# EAGLE design touchsynth (EAGLE 6.2)
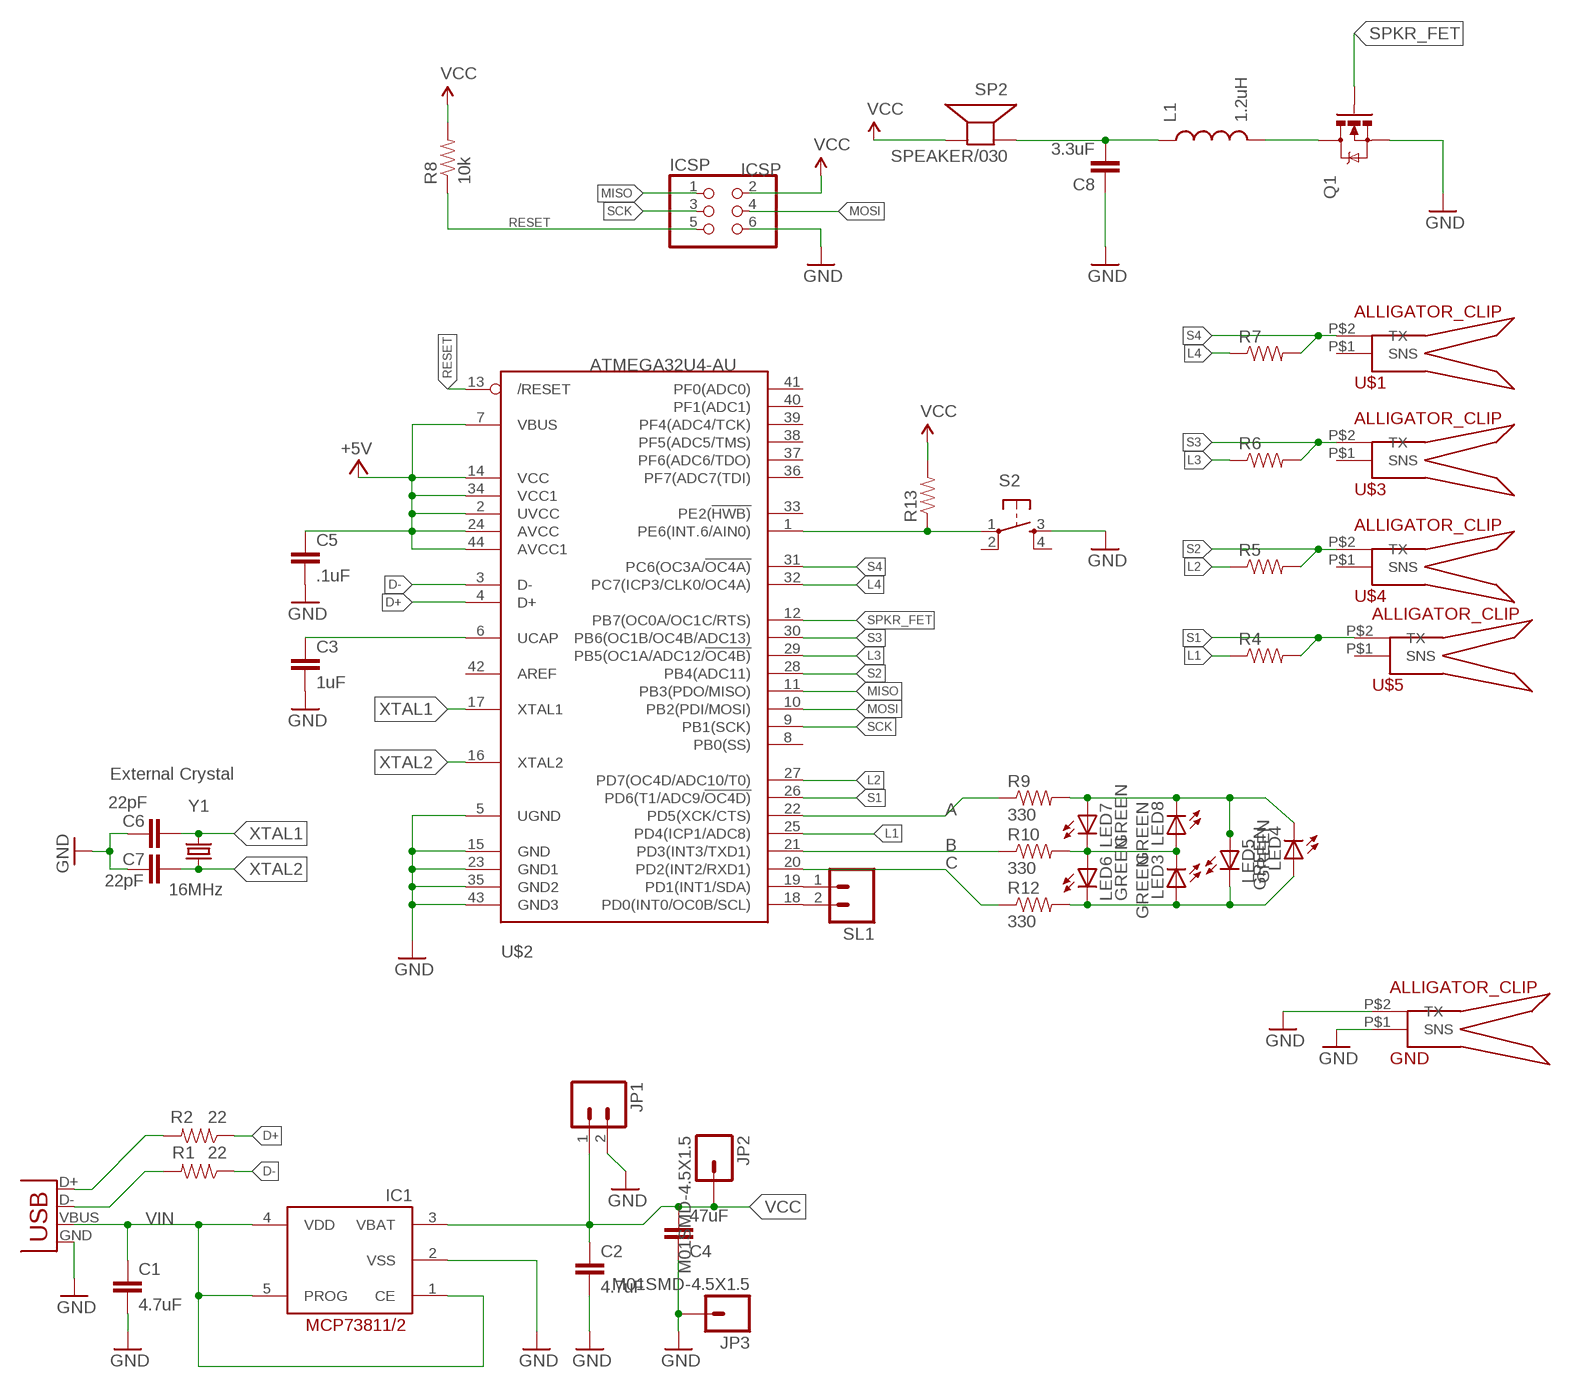
[diagram p0: schematic, sheet 1]

## Parts
C1  4.7uF  CAP0603-CAP  [0603-CAP]
C2  4.7uF  CAP0603-CAP  [0603-CAP]
C3  1uF  CAP0603-CAP  [0603-CAP]
C4  47uF  CAP1206  [1206]
C5  .1uF  CAP0603-CAP  [0603-CAP]
C6  22pF  CAP0402-CAP  [0402-CAP]
C7  22pF  CAP0402-CAP  [0402-CAP]
C8  3.3uF  CAP0603-CAP  [0603-CAP]
GND  ALLIGATOR_CLIP  [ALLIGATOR_CLIP]
IC1  MCP73811/2  [SOT23-5L]
ICSP  ICSP  PINHD-2X3  [2X03]
JP1  M02PTH  [1X02]
JP2  M01SMD-4.5X1.5  [PAD-1.5X4.5]
JP3  M01SMD-4.5X1.5  [PAD-1.5X4.5]
L1  1.2uH  INDUCTOR1210  [1210]
LED3  GREEN  LED1206-BOTTOM  [LED-1206-BOTTOM]
LED4  GREEN  LED1206-BOTTOM  [LED-1206-BOTTOM]
LED5  GREEN  LED1206-BOTTOM  [LED-1206-BOTTOM]
LED6  GREEN  LED1206-BOTTOM  [LED-1206-BOTTOM]
LED7  GREEN  LED1206-BOTTOM  [LED-1206-BOTTOM]
LED8  GREEN  LED1206-BOTTOM  [LED-1206-BOTTOM]
Q1  MOSFET-NCHANNELSMD  [SOT23-3]
R1  22  RESISTOR0402-RES  [0402-RES]
R2  22  RESISTOR0402-RES  [0402-RES]
R4  RESISTOR0603-RES  [0603-RES]
R5  RESISTOR0603-RES  [0603-RES]
R6  RESISTOR0603-RES  [0603-RES]
R7  RESISTOR0603-RES  [0603-RES]
R8  10k  RESISTOR0603-RES  [0603-RES]
R9  330  RESISTOR0603-RES  [0603-RES]
R10  330  RESISTOR0603-RES  [0603-RES]
R12  330  RESISTOR0603-RES  [0603-RES]
R13  RESISTOR0603-RES  [0603-RES]
S2  TAC_SWITCHSMD  [TACTILE_SWITCH_SMD]
SL1  M02  [02P]
SP2  SPEAKER/030  [AST-030]
U$1  ALLIGATOR_CLIP  [ALLIGATOR_CLIP]
U$2  ATMEGA32U4-AU  [TQFP44-THIN]
U$3  ALLIGATOR_CLIP  [ALLIGATOR_CLIP]
U$4  ALLIGATOR_CLIP  [ALLIGATOR_CLIP]
U$5  ALLIGATOR_CLIP  [ALLIGATOR_CLIP]
X1  USB  [USB-MINIB-NOSTOP-THIN]
Y1  16MHz  CRYSTAL5X3  [CRYSTAL-SMD-5X3]

## Nets
A: R9.1 U$2.22(PD5(XCK/CTS))
B: R10.1 U$2.21(PD3(INT3/TXD1))
C: R12.1 U$2.20(PD2(INT2/RXD1))
D+: R2.1 U$2.4(D+)
D-: R1.1 U$2.3(D-)
GND [gnd]: C1.2 C2.2 C3.2 C4.1 C5.2 C6.2 C7.2 C8.1 GND.P$1(SNS) GND.P$2(TX) IC1.2(VSS) ICSP.6 JP1.2 JP3.P$1 Q1.2(S) S2.3 U$2.5(UGND) U$2.15(GND) U$2.23(GND1) U$2.35(GND2) U$2.43(GND3) X1.GND
L1: R4.1 U$2.25(PD4(ICP1/ADC8))
L2: R5.1 U$2.27(PD7(OC4D/ADC10/T0))
L3: R6.1 U$2.29(PB5(OC1A/ADC12/!OC4B))
L4: R7.1 U$2.32(PC7(ICP3/CLK0/OC4A))
MISO: ICSP.1 U$2.11(PB3(PDO/MISO))
MOSI: ICSP.4 U$2.10(PB2(PDI/MOSI))
N$1: C3.1 U$2.6(UCAP)
N$2: C8.2 L1.1 SP2.1(+)
N$3: SL1.1 U$2.19(PD1(INT1/SDA))
N$4: R13.1 S2.1 U$2.1(PE6(INT.6/AIN0))
N$5: LED3.C LED6.A LED7.C LED8.A R10.2
N$6: R1.2 X1.D-
N$7: SL1.2 U$2.18(PD0(INT0/OC0B/SCL))
N$8: R2.2 X1.D+
N$9: LED4.C LED5.A LED7.A LED8.C R9.2
N$10: LED3.A LED4.A LED5.C LED6.C R12.2
N$11: L1.2 Q1.3(D)
RESET: ICSP.5 R8.1 U$2.13(/RESET)
S1: R4.2 U$2.26(PD6(T1/ADC9/!OC4D)) U$5.P$2(TX)
S2: R5.2 U$2.28(PB4(ADC11)) U$4.P$2(TX)
S3: R6.2 U$2.30(PB6(OC1B/OC4B/ADC13)) U$3.P$2(TX)
S4: R7.2 U$1.P$2(TX) U$2.31(PC6(OC3A/!OC4A))
SCK: ICSP.3 U$2.9(PB1(SCK))
SPKR_FET: Q1.1(G) U$2.12(PB7(OC0A/OC1C/RTS))
VCC: C2.1 C4.2 C5.1 IC1.3(VBAT) ICSP.2 JP1.1 JP2.P$1 R8.2 R13.2 SP2.2(-) U$2.2(UVCC) U$2.7(VBUS) U$2.14(VCC) U$2.24(AVCC) U$2.34(VCC1) U$2.44(AVCC1) ; supply symbol labelled +5V
VIN: C1.1 IC1.1(CE) IC1.4(VDD) IC1.5(PROG) X1.VBUS
XTAL1: C6.1 U$2.17(XTAL1) Y1.3
XTAL2: C7.1 U$2.16(XTAL2) Y1.1
Unconnected: S2.2 S2.4 U$1.P$1(SNS) U$2.8(PB0(SS)) U$2.33(PE2(!HWB)) U$2.36(PF7(ADC7(TDI)) U$2.37(PF6(ADC6/TDO)) U$2.38(PF5(ADC5/TMS)) U$2.39(PF4(ADC4/TCK)) U$2.40(PF1(ADC1)) U$2.41(PF0(ADC0)) U$2.42(AREF) U$3.P$1(SNS) U$4.P$1(SNS) U$5.P$1(SNS)

## Notes on the sheet
- External Crystal

## Library data of the parts
C1-C8 = SparkFun:CAP: Capacitor Standard 0603 ceramic capacitor, and 0.1" leaded capacitor.
GND U$1 U$3-U$5 = sdgj:ALLIGATOR_CLIP
IC1 = adafruit:MCP73811/2: MCP73811 and MCP73812 Simple, Miniature Single-Cell, Fully Integrated Li-Ion / Li-Polymer Charge Management Controllers SOT-23-5 package, no indicator LED but with adjustable current, small and very inexpensive
ICSP = SmartPrj:PINHD-2X3: PIN HEADER
JP1 = SparkFun:M02: Header 2 Standard 2-pin 0.1" header. Use with straight break away headers (SKU : PRT-00116), right angle break away headers (PRT-00553), swiss pins (PRT-00743), machine pins (PRT-00117), and female headers (PRT-00115). Molex polarized connector foot print use with SKU : PRT-08233 with associated crimp pins and housings.
JP2 JP3 = SparkFun:M01: Header 1 Standard 1-pin 0.1" header. Use with straight break away headers (SKU : PRT-00116), right angle break away headers (PRT-00553), swiss pins (PRT-00743), machine pins (PRT-00117), and female headers (PRT-00115).
L1 = SparkFun:INDUCTOR: Inductors Basic Inductor/Choke - 0603 and 1206. Footprints are not proven and vary greatly between part numbers.
LED3-LED8 = SparkFun-LED:LED: LEDs Standard schematic elements and footprints for 5mm, 3mm, 1206, and 0603 sized LEDs. 5mm - Spark Fun Electronics SKU : COM-00529 (and others)
Q1 = sdgj:MOSFET-NCHANNEL: Generic NMOS footprint
R1 R2 R4-R10 R12 R13 = SparkFun:RESISTOR: Resistor Basic schematic elements and footprints for 0603, 1206, and PTH resistors.
S2 = SparkFun:TAC_SWITCH: Momentary Switch Button commonly used for reset or general input. Spark Fun Electronics SKU : COM-00097
SL1 = con-amp-quick:M02: AMP QUICK CONNECTOR; OC_FARNELL: unknown; OC_NEWARK: unknown
SP2 = sdgj:SPEAKER: SPEAKER Source: Buerklin Added PS12 (for part # PS1240 piezo) http://www.ladyada.net/library/pcb/eaglelibrary.html
U$2 = sdgj:ATMEGA32U4: http://www.ladyada.net/library/eagle
X1 = sdgj:USB: USB Connectors USB-B-PTH is fully proven SKU : PRT-00139 USB-miniB is fully proven SKU : PRT-00587 USB-A-PCB is untested. USB-A-H is throughly reviewed, but untested. Spark Fun Electronics SKU : PRT-00437 USB-B-SMT is throughly reviewed, but untested. Needs silkscreen touching up. USB-A-S has not been used/tested USB-MB-H has not been used/tested
Y1 = SparkFun:CRYSTAL: Crystals Various standard crystals. Proven footprints. Spark Fun Electronics SKU : COM-00534

## Net classes
0 default: width 0.203 mm
2 gnd: width 0.254 mm, drill 0.61 mm, clearance 0.254 mm

## Board
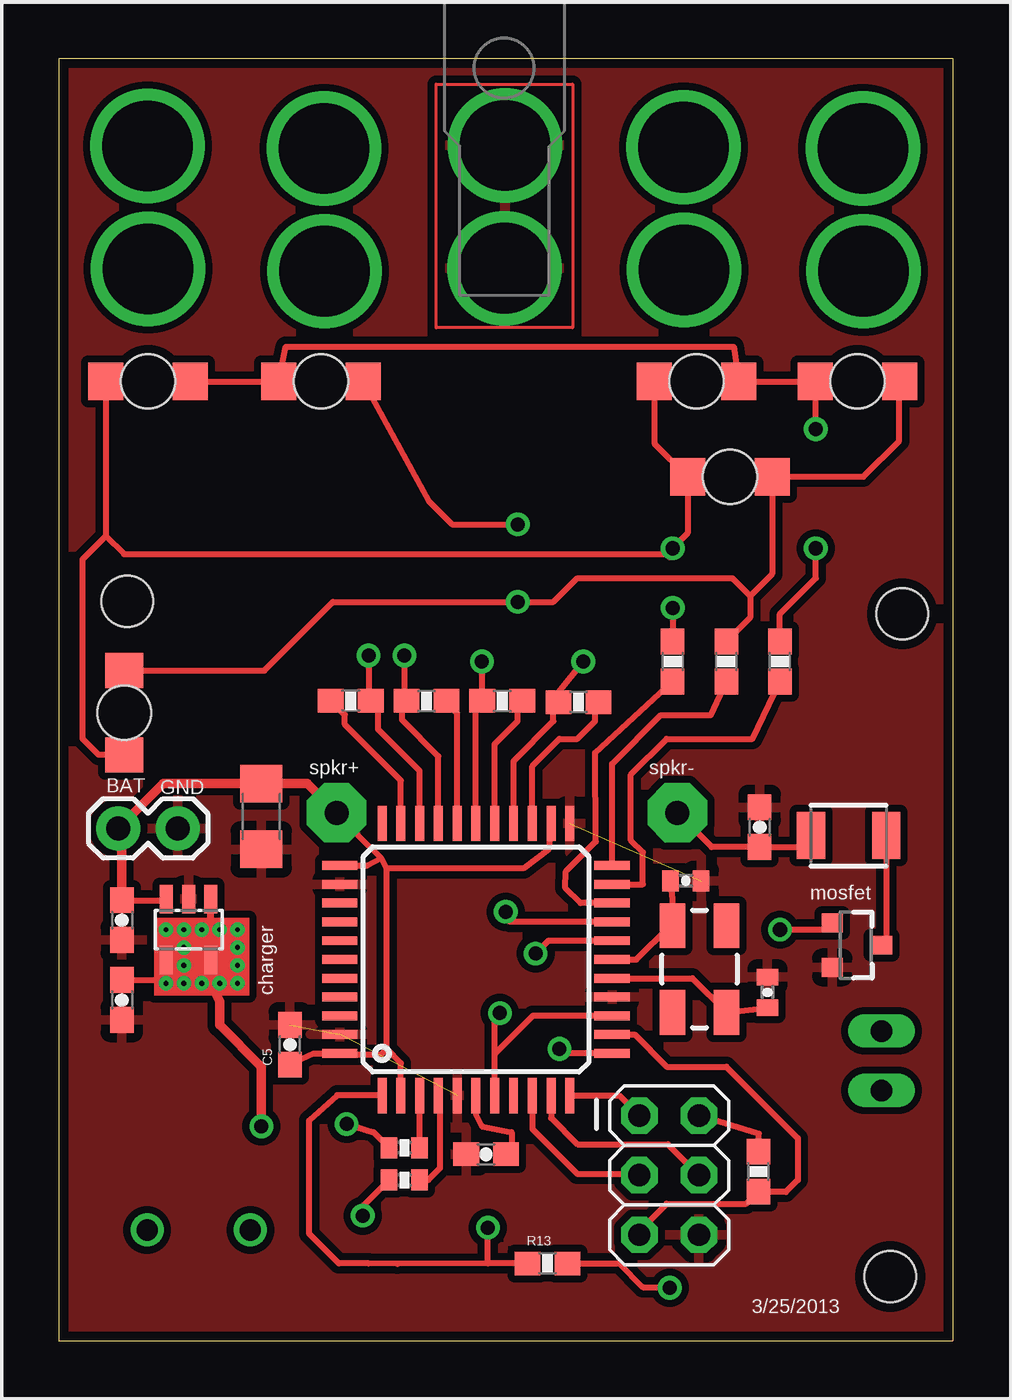
[diagram p1: board, top side]
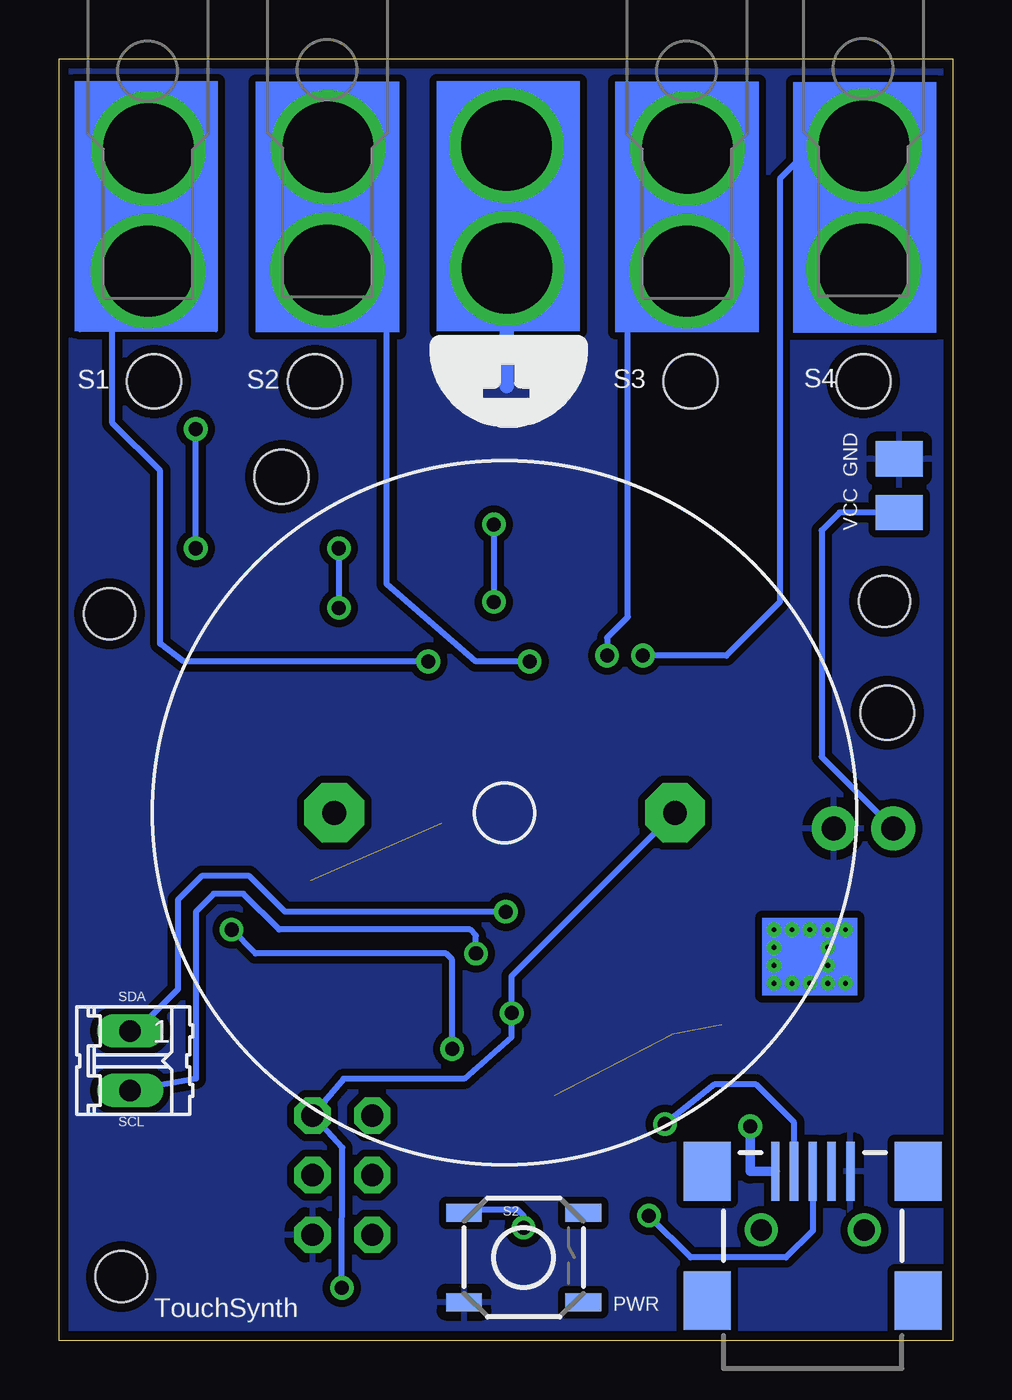
[diagram p2: board, bottom side, seen from below]

Size 38.1 x 54.65 mm. Coordinates in mm from the lower left corner, seen from the top.
Outline: 0,0 38.1,0 38.1,54.65 0,54.65 0,0
Copper layers (1*16): Top 0.035mm / dielectric 20mil / Bottom 0.035mm
Design rules: minimum track width 10mil, minimum drill 24mil, track to track 12mil, track to pad 12mil, pad to pad 12mil, via to via 12mil, smd to smd 8mil, copper to edge 16mil, drill to drill 12mil, minimum pad ring 10mil, minimum via ring 8mil, stop-mask expansion 4mil, vias tented up to drill 0mil, thermal gap 16mil
Holes 2.18 mm at 35.43,2.74 35.94,30.99 2.92,31.52

### Footprints (pad centres in the part's own frame; a part is rotated, then mirrored left to right if it is on the bottom)
0603-CAP = smd 1.1 x 1: 1 -0.85,0; 2 0.85,0
1206 = smd 1.6 x 1.8: 1 -1.4,0; 2 1.4,0
0402-CAP = smd 0.7 x 0.9: 1 -0.65,0; 2 0.65,0
ALLIGATOR_CLIP = drill 3.861: P$1 -2.667,0; P$2 2.565,-0.025
SOT23-5L = smd 0.55 x 1.2: 1 -0.95,-1.3; 2 0,-1.3; 3 0.95,-1.3; 4 0.95,1.3; 5 -0.95,1.3
2X03 = drill 0.95 pad 1.55 octagon: 1 -2.54,-1.27; 2 -2.54,1.27; 3 0,-1.27; 4 0,1.27; 5 2.54,-1.27; 6 2.54,1.27
1X02 = drill 1.016 pad 1.88: 1 0,0; 2 2.54,0
PAD-1.5X4.5 = smd 1.5 x 2: P$1 0,0
1210 = smd 1.2 x 2: 1 -1.6,0; 2 1.6,0
LED-1206-BOTTOM = smd 1.5 x 1.6: A -1.8,0; C 1.8,0 | hole 2.3: 0,0
SOT23-3 = smd 0.8 x 0.9: 1 -0.95,-1; 2 0.95,-1; 3 0,1.1
0402-RES = smd 0.7 x 0.9: 1 -0.65,0; 2 0.65,0
0603-RES = smd 1.1 x 1: 1 -0.85,0; 2 0.85,0
TACTILE_SWITCH_SMD = smd 1.524 x 0.762: 1 -2.54,1.905; 2 2.54,1.905; 3 -2.54,-1.905; 4 2.54,-1.905
02P = drill 0.914 long: 1 -1.27,0; 2 1.27,0
AST-030 = drill 1.016 pad 2.54 octagon: 1 -7.259,1.27; 2 7.259,1.27
TQFP44-THIN = smd 1.5 x 0.381: 1 -5.8,4; 2 -5.8,3.2; 3 -5.8,2.4; 4 -5.8,1.6; 5 -5.8,0.8; 6 -5.8,0; 7 -5.8,-0.8; 8 -5.8,-1.6; 9 -5.8,-2.4; 10 -5.8,-3.2; 11 -5.8,-4; 23 5.8,-4; 24 5.8,-3.2; 25 5.8,-2.4; 26 5.8,-1.6; 27 5.8,-0.8; 28 5.8,0; 29 5.8,0.8; 30 5.8,1.6; 31 5.8,2.4; 32 5.8,3.2; 33 5.8,4 | smd 0.381 x 1.5: 12 -4,-5.8; 13 -3.2,-5.8; 14 -2.4,-5.8; 15 -1.6,-5.8; 16 -0.8,-5.8; 17 0,-5.8; 18 0.8,-5.8; 19 1.6,-5.8; 20 2.4,-5.8; 21 3.2,-5.8; 22 4,-5.8; 34 4,5.8; 35 3.2,5.8; 36 2.4,5.8; 37 1.6,5.8; 38 0.8,5.8; 39 0,5.8; 40 -0.8,5.8; 41 -1.6,5.8; 42 -2.4,5.8; 43 -3.2,5.8; 44 -4,5.8
USB-MINIB-NOSTOP-THIN = smd 2.5 x 0.356: D+ 2.5,0; D- 2.5,0.8; GND 2.5,-1.6; ID 2.5,-0.8; VBUS 2.5,1.6 | smd 2.5 x 2: G1 -3,-4.5; G2 -3,4.5; G3 2.5,4.5; G4 2.5,-4.5 | drill 0.9 pad 0.8: H1 0,2.2 | drill 0.9 pad 0.787: H2 0,-2.2
CRYSTAL-SMD-5X3 = smd 1.9 x 1.1: 1 -1.85,-1.15; 2 1.85,-1.15; 3 1.85,1.15; 4 -1.85,1.15

### Placement (x,y rotation side)
C1  2.69,14.53 270 top
C2  2.69,17.93 270 top
C3  18.21,7.95 180 top
C4  8.64,22.35 90 top
C5  9.86,12.62 90 top
C6  26.72,19.61 0 top
C7  30.2,14.86 90 top
C8  29.87,21.89 270 top
GND  19,48.39 90 top
IC1  5.54,17.53 180 top
ICSP  26.01,7.06 270 top
JP1  2.54,21.84 0 top
JP2  2.29,35.31 270 bottom
JP3  2.29,37.59 270 bottom
L1  33.66,21.54 0 top
LED3  3.81,40.89 0 top
LED4  28.6,36.83 0 top
LED5  2.79,26.77 270 top
LED6  27.18,40.89 180 top
LED7  34.04,40.89 180 top
LED8  11.18,40.89 0 top
Q1  33.96,16.87 270 top
R1  14.73,8.23 180 top
R2  14.73,6.86 180 top
R4  22.15,27.23 180 top
R5  18.9,27.28 180 top
R6  15.67,27.28 180 top
R7  12.45,27.28 0 top
R8  29.82,7.21 90 top
R9  28.45,28.96 90 top
R10  30.73,28.96 90 top
R12  26.16,28.96 90 top
R13  20.83,3.3 0 top
S2  18.29,3.56 0 bottom
SL1  35.05,11.94 270 bottom
SP2  19.1,21.23 0 bottom
U$1  3.81,48.36 90 bottom
U$2  17.78,16.26 90 top
U$3  11.33,48.26 90 bottom
U$4  26.64,48.31 90 bottom
U$5  34.29,48.26 90 bottom
X1  5.97,4.72 90 bottom
Y1  27.3,15.85 90 top

### Tracks (layer width: path | path; a pad name or v marks a point on that pad's centre or on a via)
A
  Top 0.254: U$2.22 23.58,24.6 25.65,26.67 27.77,26.67 R9.1
B
  Top 0.254: U$2.21 24.28,19.46 24.89,19.46 24.89,20.83 24.38,21.34 24.38,24.13 25.91,25.65 29.55,25.65 R10.1
C
  Top 0.254: U$2.20 22.24,18.66 21.59,19.3 21.62,20.02 22.88,21.28 22.86,25.06 R12.1
D+
  Top 0.254: R2.1 15.75,6.86 16.26,7.37 16.26,10.38 U$2.4
D-
  Top 0.254: R1.1 U$2.3
GND  (3 unrouted)
  Bottom 0.254: 19,40.69 19.05,40.64
  Bottom 0.61: GND.P$1 19,40.69
  pour Top: 0,54.61 38.1,54.61 38.1,0 0,0
  pour Bottom: 0.2,54.66 38,54.66 38,0 0,0 0,54.66
L1
  Top 0.254: U$2.25 20.18,24.5 21.34,25.65 22.1,25.65 22.86,26.42 22.86,27.09 R4.1
L2
  Top 0.254: U$2.27 18.58,25.44 19.56,26.42 19.56,27.09 R5.1
L3
  Top 0.254: U$2.29 16.98,26.74 R6.1
L4
  Top 0.254: U$2.32 14.58,23.88 12.19,26.26 12.19,26.68 R7.1
MISO
  Top 0.254: U$2.11 23.88,10.46 ICSP.1
MOSI
  Top 0.254: U$2.10 20.98,9.5 22.1,8.38 25.96,8.38 ICSP.4
N$1
  Top 0.254: U$2.6 17.78,9.65 18.03,9.14 19.3,8.89 19.3,8.22 C3.1
N$2
  Top 0.254: SP2.1 27.82,21.05 C8.2 31.56,21.05 L1.1
N$3  (via drill 0.6)
  Top 0.254: U$2.19 19.23,17.86 19.05,18.03 v19.05,18.29
  Bottom 0.254: v19.05,18.29 28.45,18.29 29.97,19.81 32,19.81 33.02,18.8 33.02,14.99 34.8,13.21 SL1.1
N$4  (via drill 0.6)
  Top 0.254: U$2.1 11.86,10.46 10.67,9.4 10.67,4.57 11.94,3.3 13.21,3.3 14.43,3.28 R13.1 18.29,3.3 v18.29,4.83
  Bottom 0.254: v18.29,4.83 18.29,5.33 18.54,5.59 20.7,5.59 S2.1
N$5  (via drill 0.6)
  Top 0.254: LED3.C LED8.A 9.68,42.37 13.97,42.37 25.91,42.37 28.75,42.37 LED6.A LED7.C 32.26,41.13 v32.26,38.86 | R10.2 30.73,30.99 32.26,32.51 v32.26,33.78
  Bottom 0.254: v32.26,33.78 v32.26,38.86
N$6  (via drill 0.6)
  Top 0.254: v12.27,9.25 13.42,8.89 R1.2
  Bottom 0.254: X1.D- 6.77,9.31 8.38,10.92 10.16,10.92 v12.27,9.25
N$7  (via drill 0.6)
  Top 0.254: U$2.18 20.87,17.06 v20.32,16.51
  Bottom 0.254: v20.32,16.51 20.32,17.27 20.57,17.53 28.7,17.53 30.23,19.05 31.5,19.05 32.26,18.29 32.26,11.18 SL1.2
N$8  (via drill 0.6)
  Top 0.254: v12.95,5.33 12.95,5.73 R2.2
  Bottom 0.254: X1.D+ 5.97,4.7 7.11,3.56 11.18,3.56 v12.95,5.33
N$9  (via drill 0.6)
  Top 0.254: LED8.C 15.77,35.79 16.76,34.8 v19.56,34.8 | 29.46,31.75 30.4,32.69 LED4.C 34.29,36.83 35.81,38.35 35.81,41.13 LED7.A | 29.46,31.75 29.46,30.82 R9.2 | 29.46,31.75 28.7,32.51 22.1,32.51 21.08,31.5 v19.56,31.5 11.68,31.5 8.76,28.57 LED5.A
  Bottom 0.254: v19.56,34.8 v19.56,31.5
N$10  (via drill 0.6)
  Top 0.254: LED3.A 2.01,34.31 | 2.01,34.31 2.79,33.53 25.91,33.53 v26.16,33.78 | v26.16,33.78 26.8,34.42 LED4.A 25.38,38.25 LED6.C | v26.16,31.24 R12.2 | 26.04,33.4 v26.16,33.78 | LED5.C 1.7,24.97 1.02,25.65 1.02,33.32 2.01,34.31
  Bottom 0.254: v26.16,33.78 v26.16,31.24
N$11
  Top 0.254: L1.2 35.26,16.78 Q1.3
N$13  (via drill 0.2)
  Bottom 0.254: v7.62,16 v7.62,16.76
N$14  (via drill 0.2)
  other vias: 7.62,15.24
N$15  (via drill 0.2)
  other vias: 6.86,15.24
N$16  (via drill 0.2)
  other vias: 6.1,15.24
N$17  (via drill 0.2)
  other vias: 5.33,15.24
N$18  (via drill 0.2)
  other vias: 4.57,17.53
N$19  (via drill 0.2)
  other vias: 5.33,17.53
N$20  (via drill 0.2)
  other vias: 6.1,17.53
N$21  (via drill 0.2)
  other vias: 6.86,17.53
N$22  (via drill 0.2)
  other vias: 7.62,17.53
N$23  (via drill 0.2)
  other vias: 4.57,15.24
N$24  (via drill 0.2)
  other vias: 5.33,16
N$25  (via drill 0.2)
  other vias: 5.33,16.76
RESET
  Top 0.254: ICSP.5 24.74,4.67 25.91,5.84 29.3,5.84 R8.1 29.83,6.35 30.99,6.35 31.5,6.86 31.5,8.64 28.45,11.68 25.91,11.68 24.54,13.06 U$2.13
S1  (via drill 0.6)
  Top 0.254: U$2.26 19.38,24.71 21.08,26.42 21.08,27.01 R4.2 21.3,27.65 v22.35,28.96
  Bottom 0.254: v22.35,28.96 32.77,28.96 33.78,29.72 33.78,37.08 35.81,39.12 35.81,49.28 | 33.78,50.8 U$5.P$2
  Bottom 0.406: 35.81,49.28 U$5.P$2
S2  (via drill 0.6)
  Top 0.254: U$2.28 17.78,27.01 R5.2 18.05,28.94 v18.03,28.96
  Bottom 0.254: v18.03,28.96 20.32,28.96 24.13,32.26 24.13,43.18 24.64,43.18 24.64,47.5 24.38,48.01 24.38,48.16 U$4.P$2
S3  (via drill 0.6)
  Top 0.254: U$2.30 16.18,24.92 14.63,26.47 14.63,27.06 R6.2 14.73,27.37 v14.73,29.21
  Bottom 0.254: v14.73,29.21 14.73,29.97 13.84,30.86 13.84,48.79 U$3.P$2
  Bottom 0.406: U$3.P$2 11.68,48.92 11.94,48.92
S4  (via drill 0.6)
  Top 0.254: U$2.31 15.38,24.3 13.61,26.06 13.61,26.96 R7.2 13.21,27.37 v13.21,29.21
  Bottom 0.254: U$1.P$2 5.97,50.93 7.37,49.53 7.37,31.5 9.65,29.21 v13.21,29.21
SCK
  Top 0.254: U$2.9 20.18,9.03 22.1,7.11 24.69,7.11 ICSP.3
SPKR_FET  (via drill 0.6)
  Top 0.254: U$2.12 21.53,12.26 v21.34,12.45 | v30.73,17.53 32.67,17.53 Q1.1
  Bottom 0.254: v21.34,12.45 21.34,16.26 21.59,16.51 29.72,16.51 v30.73,17.53
VCC  (via drill 0.6)
  Top 0.254: 13.97,12.45 13.97,20.14 | 13.97,20.14 13.74,20.57 | 13.74,20.57 12.73,21.59 12.45,21.9 | 13.97,12.45 14.58,11.84 U$2.2 | U$2.24 20.88,20.95 19.81,20.14 13.97,20.14 | U$2.7 18.58,12.23 | R8.2 29.83,8.83 ICSP.2 27.23,9.6 | U$2.34 13.14,20.26 13.74,20.57 | C2.1 4.54,18.78 | 13.97,12.45 13.72,12.19 12.04,12.19 U$2.44 10.87,12.24 C5.1 | U$2.14 20.21,13.86 18.58,12.23 | 18.58,12.23 18.58,13.75 v18.8,13.97 | R13.2 23.88,3.3 24.89,2.29 26.01,2.29 v26.04,2.26
  Top 0.305: 4.54,18.78 IC1.3
  Top 0.406: 12.45,21.9 SP2.2 10.59,23.75 C4.2 4.45,23.75 JP1.1 2.69,21.69 C2.1
  Bottom 0.254: v26.04,2.26 26.01,8.23 ICSP.2 25.96,11.18 20.83,11.18 18.8,12.95 v18.8,13.97 18.8,15.55 SP2.2 | JP1.1 5.59,24.89 5.59,34.54 4.83,35.31 JP2.P$1
VIN  (via drill 0.6)
  Top 0.254: C1.1 5.26,15.38 IC1.4
  Top 0.305: IC1.5 IC1.1
  Top 0.406: IC1.4 IC1.5 6.6,14.99 6.86,14.48 6.86,13.46 8.64,11.68 v8.64,9.14
  Bottom 0.406: X1.VBUS 8.64,7.22 v8.64,9.14
XTAL1
  Top 0.254: C6.1 26.16,18.84 Y1.3 26.03,17.67 24.61,16.26 U$2.17
XTAL2
  Top 0.254: C7.1 29.98,14.18 Y1.1 27,15.46 U$2.16
(copper drawn outside any net)
  shapes: Bottom area x6, Top area x2

### Text on the board
tNames: spkr+ | spkr- | BAT | GND | mosfet | charger | 3/25/2013
bNames: S4 | S3 | S2 | S1 | GND | VCC | SDA | SCL | PWR | TouchSynth
tValues: 18pF | 18pF | CRYSTAL
bDocu: spkr